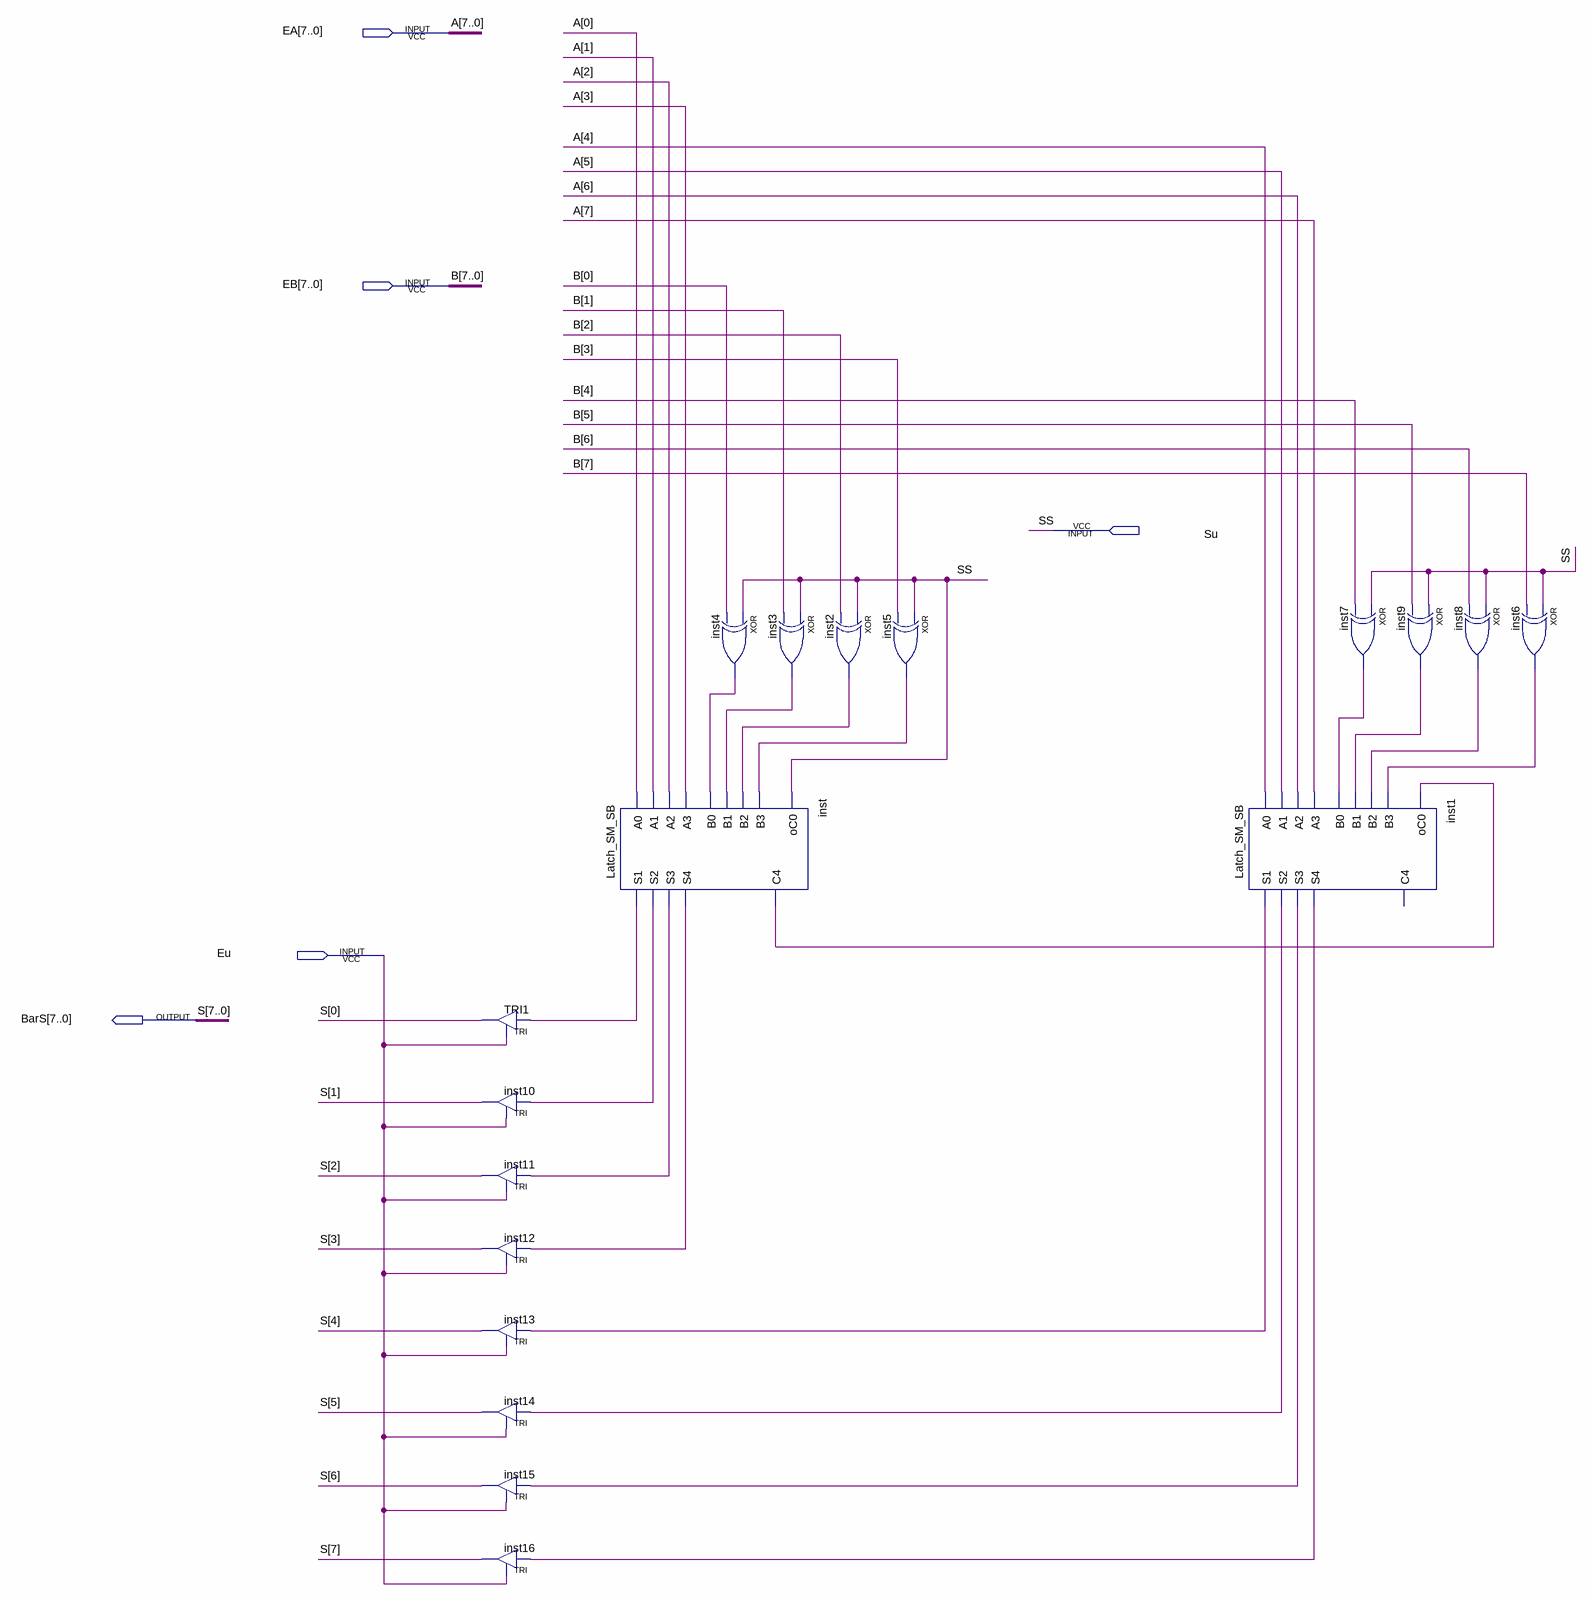
[diagram p0: schematic sheet]
// Quartus schematic Somador_Subtrator.bdf as structural Verilog: 18 symbols, 5 pins
module Somador_Subtrator (
  input  [7:0] EA,
  input  [7:0] EB,
  input  Su,
  input  Eu,
  output [7:0] BarS
);

  wire inst1_s1, inst1_s2, inst1_s3, inst1_s4, inst2_out, inst3_out, inst4_out, inst5_out, inst6_out,
       inst7_out, inst8_out, inst9_out, inst_c4, inst_s1, inst_s2, inst_s3, inst_s4;

  TRI TRI1 (.IN(inst_s1), .OE(Eu), .OUT(BarS[0]));
  TRI inst10 (.IN(inst_s2), .OE(Eu), .OUT(BarS[1]));
  TRI inst11 (.IN(inst_s3), .OE(Eu), .OUT(BarS[2]));
  TRI inst12 (.IN(inst_s4), .OE(Eu), .OUT(BarS[3]));
  TRI inst13 (.IN(inst1_s1), .OE(Eu), .OUT(BarS[4]));
  TRI inst14 (.IN(inst1_s2), .OE(Eu), .OUT(BarS[5]));
  TRI inst15 (.IN(inst1_s3), .OE(Eu), .OUT(BarS[6]));
  TRI inst16 (.IN(inst1_s4), .OE(Eu), .OUT(BarS[7]));
  Latch_SM_SB inst (
    .A0(EA[0]), .A1(EA[1]), .A2(EA[2]), .A3(EA[3]), .B0(inst4_out), .B1(inst3_out), .B2(inst2_out),
    .B3(inst5_out), .oC0(Su), .C4(inst_c4), .S4(inst_s4), .S3(inst_s3), .S2(inst_s2), .S1(inst_s1));
  xor inst4 (inst4_out, Su, EB[0]);
  xor inst3 (inst3_out, Su, EB[1]);
  xor inst2 (inst2_out, Su, EB[2]);
  xor inst5 (inst5_out, Su, EB[3]);
  Latch_SM_SB inst1 (
    .A0(EA[4]), .A1(EA[5]), .A2(EA[6]), .A3(EA[7]), .B0(inst7_out), .B1(inst9_out), .B2(inst8_out),
    .B3(inst6_out), .oC0(inst_c4), .S4(inst1_s4), .S3(inst1_s3), .S2(inst1_s2), .S1(inst1_s1));  // open: C4
  xor inst7 (inst7_out, Su, EB[4]);
  xor inst8 (inst8_out, Su, EB[6]);
  xor inst9 (inst9_out, Su, EB[5]);
  xor inst6 (inst6_out, Su, EB[7]);

  // Other names for the same wires on the sheet: A[7:0] = EA; B[7:0] = EB; S[7:0] = BarS; SS = Su
endmodule
